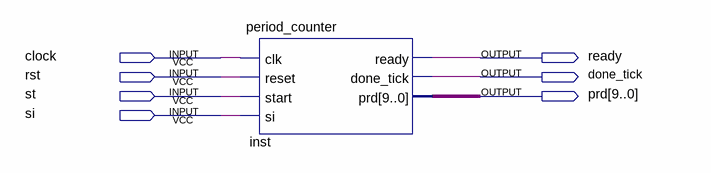
[diagram p0: schematic sheet]
// Quartus schematic top.bdf as structural Verilog: 1 symbols, 7 pins
module top (
  input  clock,
  input  rst,
  input  st,
  input  si,
  output ready,
  output done_tick,
  output [9:0] prd
);

  period_counter inst (.clk(clock), .reset(rst), .start(st), .si(si), .ready(ready), .done_tick(done_tick), .prd(prd));
endmodule
